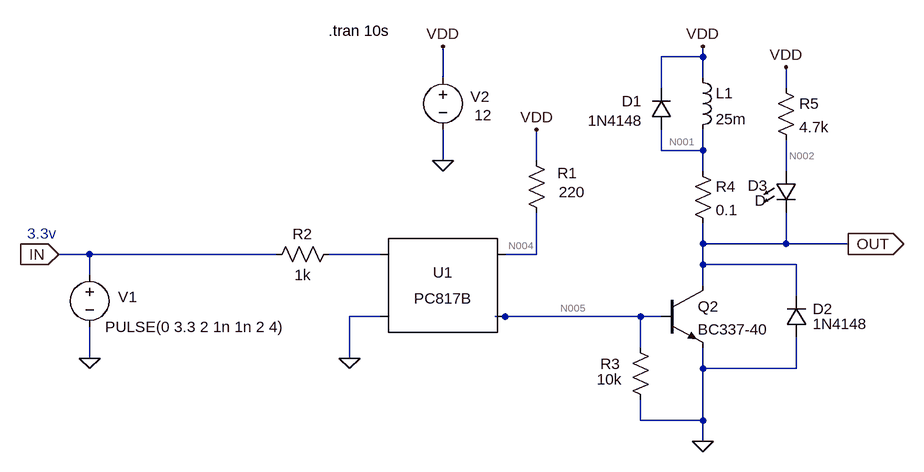
[diagram p0: schematic v1.0.asc]
v1.0.asc, the LTspice schematic file:
Version 4.1
SHEET 1 1116 680
WIRE 624 -176 624 -192
WIRE 624 -176 560 -176
WIRE 224 -144 224 -192
WIRE 624 -144 624 -176
WIRE 560 -128 560 -176
WIRE 752 -128 752 -160
WIRE 560 -32 560 -64
WIRE 624 -32 624 -64
WIRE 624 -32 560 -32
WIRE 224 -16 224 -64
WIRE 368 -16 368 -64
WIRE 624 0 624 -32
WIRE 752 0 752 -48
WIRE 624 112 624 80
WIRE 752 112 752 64
WIRE 752 112 624 112
WIRE 848 112 752 112
WIRE -320 128 -368 128
WIRE -32 128 -320 128
WIRE 128 128 48 128
WIRE 368 128 368 64
WIRE 368 128 320 128
WIRE 624 144 624 112
WIRE 768 144 624 144
WIRE -320 160 -320 128
WIRE 624 176 624 144
WIRE 768 192 768 144
WIRE 128 224 80 224
WIRE 320 224 304 224
WIRE 528 224 320 224
WIRE 560 224 528 224
WIRE 528 272 528 224
WIRE -320 288 -320 240
WIRE 80 288 80 224
WIRE 624 304 624 272
WIRE 768 304 768 256
WIRE 768 304 624 304
WIRE 528 384 528 352
WIRE 624 384 624 304
WIRE 624 384 528 384
WIRE 624 416 624 384
FLAG 80 288 0
FLAG -320 288 0
FLAG 224 -16 0
FLAG -368 128 IN
IOPIN -368 128 In
FLAG 624 416 0
FLAG 224 -192 VDD
FLAG 368 -64 VDD
FLAG 624 -192 VDD
FLAG 848 112 OUT
IOPIN 848 112 Out
FLAG 752 -160 VDD
SYMBOL Optos\\PC817B 224 176 R0
SYMATTR InstName U1
SYMBOL res 352 -32 R0
WINDOW 0 48 35 Left 2
WINDOW 3 50 64 Left 2
SYMATTR InstName R1
SYMATTR Value 220
SYMBOL voltage -320 144 R0
WINDOW 123 0 0 Left 0
WINDOW 39 0 0 Left 0
WINDOW 0 44 50 Left 2
SYMATTR InstName V1
SYMATTR Value PULSE(0 3.3 2 1n 1n 2 4)
SYMBOL res 64 112 R90
WINDOW 0 0 56 VBottom 2
WINDOW 3 32 56 VTop 2
SYMATTR InstName R2
SYMATTR Value 1k
SYMBOL voltage 224 -160 R0
WINDOW 123 0 0 Left 0
WINDOW 39 0 0 Left 0
WINDOW 0 42 45 Left 2
WINDOW 3 48 74 Left 2
SYMATTR InstName V2
SYMATTR Value 12
SYMBOL npn 560 176 R0
SYMATTR InstName Q2
SYMATTR Value BC337-40
SYMBOL res 512 256 R0
WINDOW 0 -46 41 Left 2
WINDOW 3 -51 65 Left 2
SYMATTR InstName R3
SYMATTR Value 10k
SYMBOL ind 608 -160 R0
SYMATTR InstName L1
SYMATTR Value 25m
SYMATTR SpiceLine Rser=100
SYMBOL diode 576 -64 R180
WINDOW 0 46 44 Left 2
WINDOW 3 44 14 Left 2
SYMATTR InstName D1
SYMATTR Value 1N4148
SYMBOL res 608 -16 R0
SYMATTR InstName R4
SYMATTR Value 0.1
SYMBOL diode 784 256 R180
WINDOW 0 -40 44 Left 2
WINDOW 3 -94 21 Left 2
SYMATTR InstName D2
SYMATTR Value 1N4148
SYMBOL LED 736 0 R0
WINDOW 0 -43 22 Left 2
WINDOW 3 -32 45 Left 2
SYMATTR InstName D3
SYMBOL res 736 -144 R0
SYMATTR InstName R5
SYMATTR Value 4.7k
TEXT 48 -216 Left 2 !.tran 10s
TEXT -416 96 Left 2 ;3.3v

The netlist it stands for:
* v1.0.asc
X§U1 N003 0 N004 N005 PC817 Igain=1.5m
R1 VDD N004 220
V1 IN 0 PULSE(0 3.3 2 1n 1n 2 4)
R2 N003 IN 1k
V2 VDD 0 12
Q2 OUT N005 0 0 BC337-40
R3 N005 0 10k
L1 VDD N001 25m Rser=100
D1 N001 VDD 1N4148
R4 N001 OUT 0.1
D2 0 OUT 1N4148
D3 N002 OUT D
R5 VDD N002 4.7k
.model D D
.lib standard.dio
.model NPN NPN
.model PNP PNP
.lib standard.bjt
.tran 10s
* 3.3v
.lib PC817.sub
.backanno
.end

* Results of the author's LTspice run, read from the files saved beside the schematic
* Operating Point, zero values left out:
*   V(n001) = 12 V
*   V(n002) = 12 V
*   V(n004) = 12 V
*   V(n005) = 609.4 nV
*   V(out) = 12 V
*   V(vdd) = 12 V
*   I(D2) = -2.532 nA
*   I(L1) = 2.544 nA
*   I(R1) = 48.88 pA
*   I(R3) = 60.94 pA
*   I(R4) = 2.544 nA
*   I(V2) = -2.593 nA
*   Ib(Q2) = -12.07 pA
*   Ic(Q2) = 12.15 pA
*   Ix(u1:3) = 48.88 pA
*   Ix(u1:4) = -48.87 pA
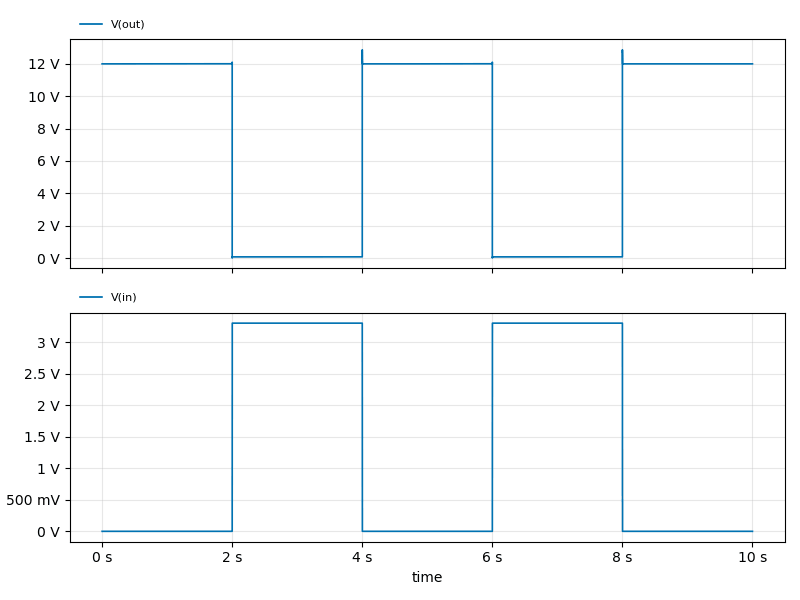
[diagram p1: Transient Analysis of v1.0.asc, plotted from the saved traces]
* Transient Analysis, 1 run:
*   V(out): min 5.584 mV, max 12.87 V, average 7.23 V, rms 9.295 V, last 12 V
*   V(in): min 0 V, max 3.3 V, average 1.32 V, rms 2.087 V, last 0 V